# Altium schematic sheet Timebase_shcematics.SchDoc: Ultra-Precision low speed ramp generator for low current calibration
size A3; PageSetup: Record=PageOptions|CenterHorizontal=True|CenterVertical=True|PrintScale=0.52|XCorrection=1.00|YCorrection=1.00|PrintKind=0|BorderSize=5000000|LeftOffset=0|BottomOffset=0|Orientation=2|PaperLength=1000|PaperWidth=1000|Scale=100|PaperSource=7|PrintQuality=-3|MediaType=1|DitherType=10|PrintScaleMode=1|PaperKind=A4|PaperIndex=9
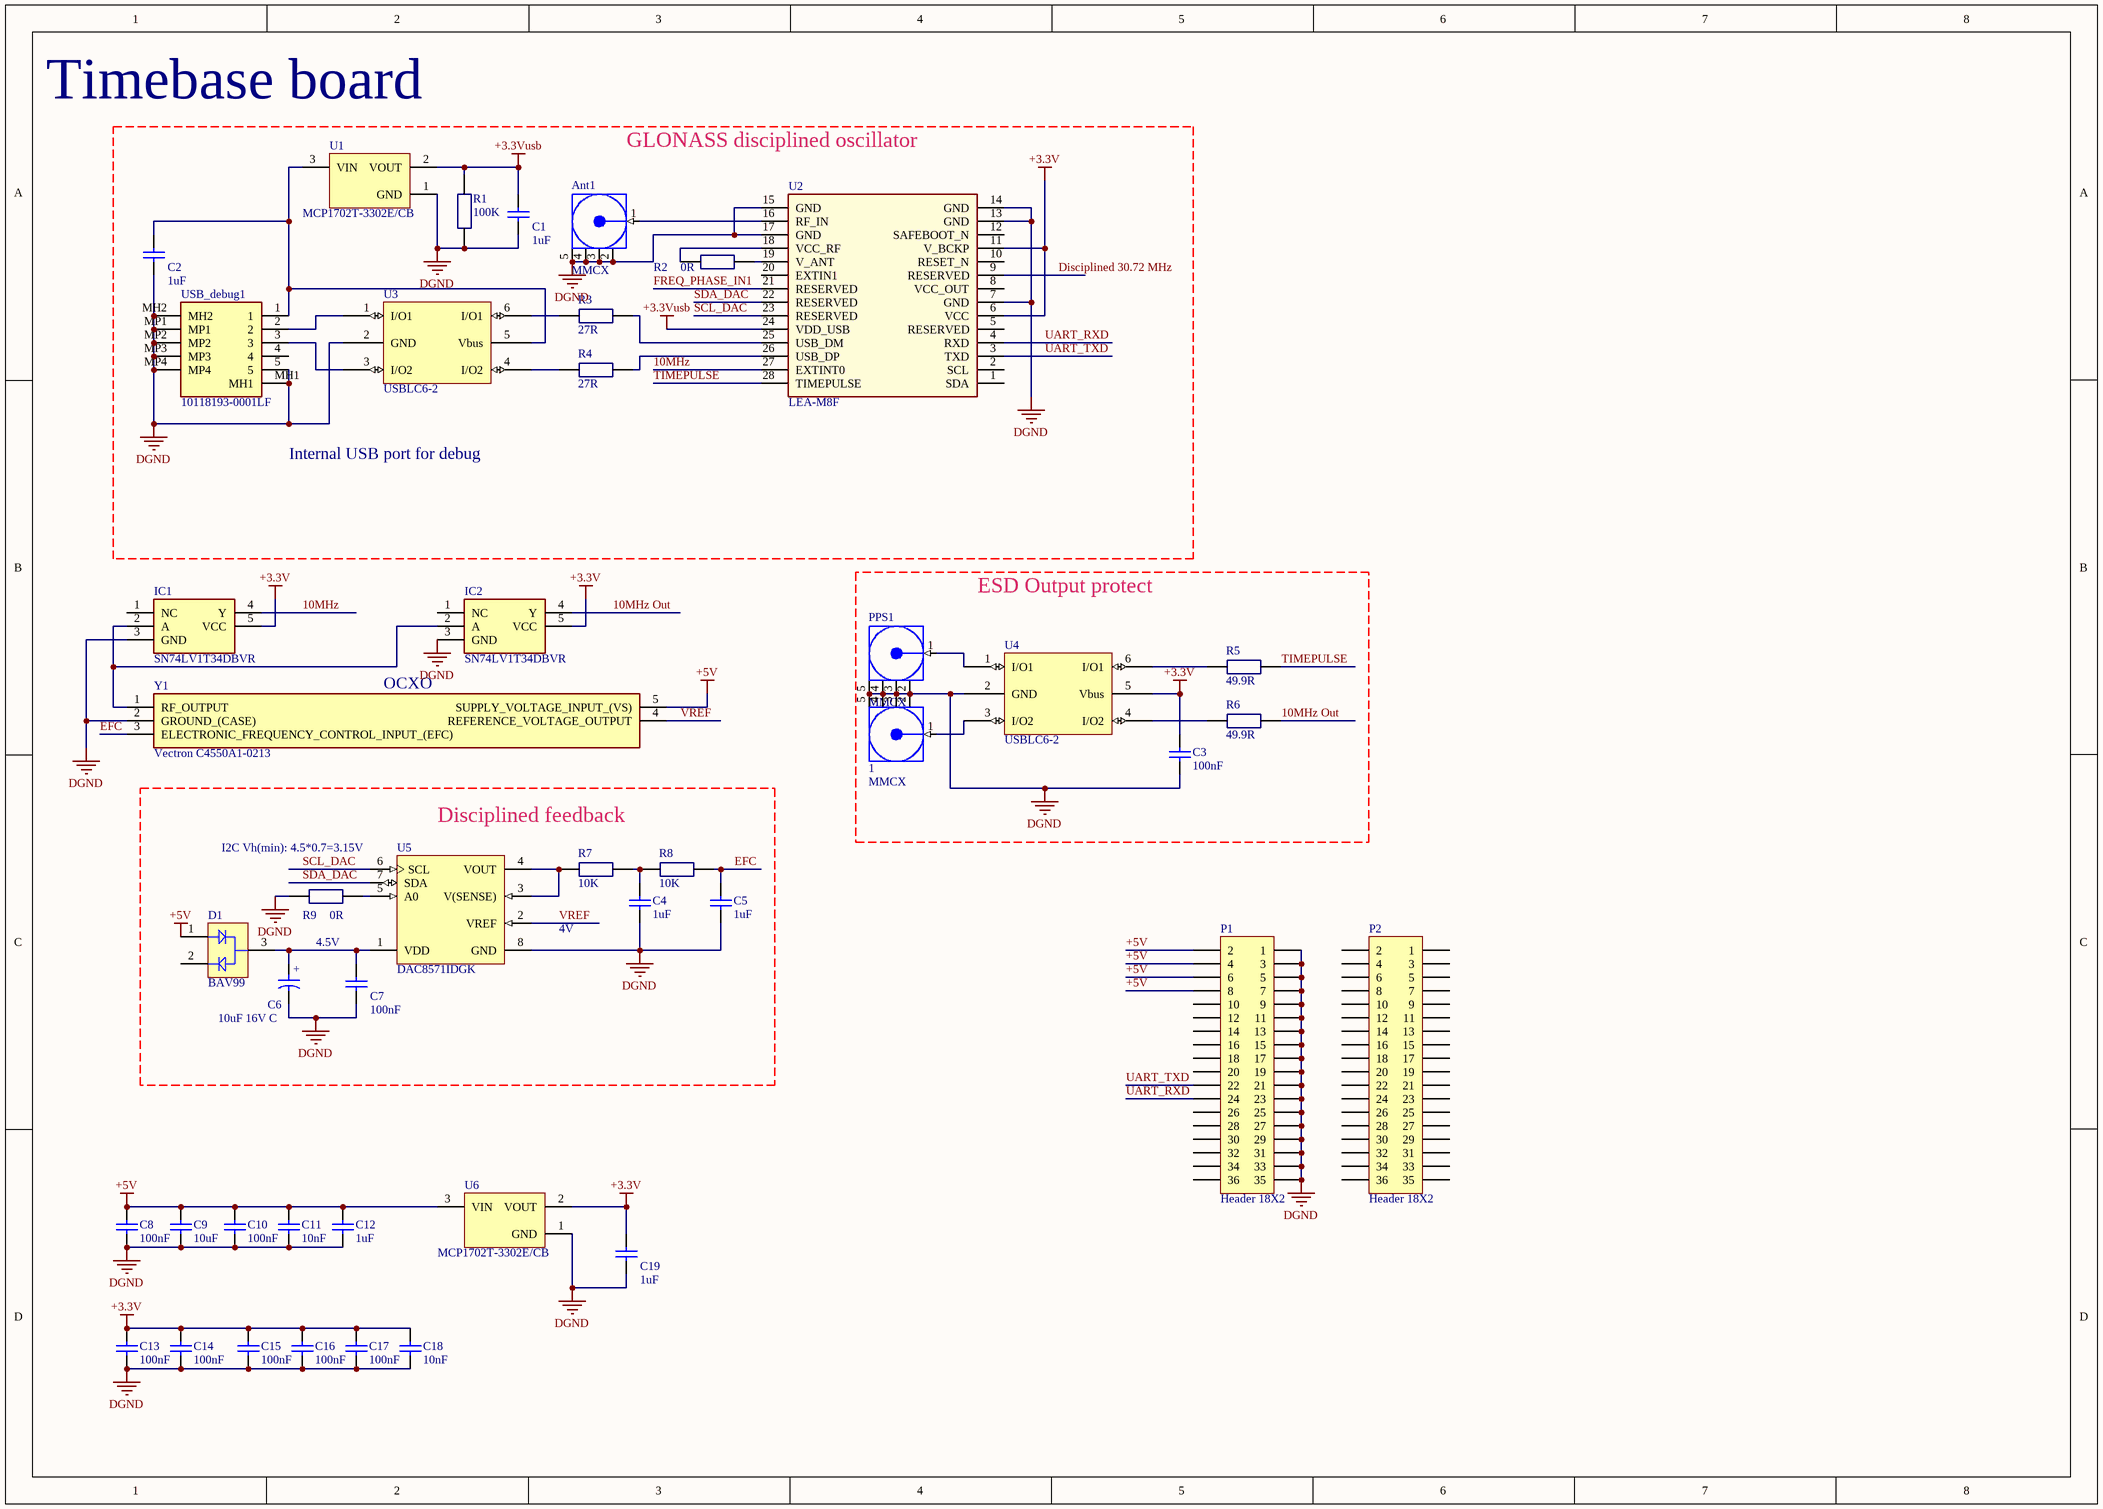
[diagram p0: Timebase_shcematics.SchDoc]

## Parts
1  MMCX  [MMCX2.54-V5]
Ant1  MMCX  [MMCX2.54-V5]
C1  1uF  [CAP 0603]
C2  1uF  [CAP 0603]
C3  100nF  [CAP 0603]
C4  1uF  [CAP 0603]
C5  1uF  [CAP 0603]
C6  10uF 16V C  [CAPMP6032X280N]
C7  100nF  [CAP 0603]
C8  100nF  [CAP 0603]
C9  10uF  [CAP 0603]
C10  100nF  [CAP 0603]
C11  10nF  [CAP 0603]
C12  1uF  [CAP 0603]
C13  100nF  [CAP 0603]
C14  100nF  [CAP 0603]
C15  100nF  [CAP 0603]
C16  100nF  [CAP 0603]
C17  100nF  [CAP 0603]
C18  10nF  [CAP 0603]
C19  1uF  [CAP 0603]
D1  BAV99  [INF-SOT23_N]
IC1  SN74LV1T34DBVR  [SOT95P280X145-5N]
IC2  SN74LV1T34DBVR  [SOT95P280X145-5N]
P1  Header 18X2  [HDR2X18]
P2  Header 18X2  [HDR2X18]
PPS1  MMCX  [MMCX2.54-V5]
R1  100K  [1608[0603]]
R2  0R  [1608[0603]]
R3  27R  [1608[0603]]
R4  27R  [1608[0603]]
R5  49.9R  [1608[0603]]
R6  49.9R  [1608[0603]]
R7  10K  [1608[0603]]
R8  10K  [1608[0603]]
R9  0R  [1608[0603]]
U1  MCP1702T-3302E/CB  [SOT-23A-CB3_N]
U2  LEA-M8F  [LEA]
U3  USBLC6-2  [SOT23-6L]
U4  USBLC6-2  [SOT23-6L]
U5  DAC8571IDGK  [TI-DGK8_N]
U6  MCP1702T-3302E/CB  [SOT-23A-CB3_N]
USB_debug1  10118193-0001LF  [101181930001LF]
Y1  Vectron C4550A1-0213  [C4550C508SV120RFSA11128MHZ]

## Blocks framed on the sheet
GLONASS disciplined oscillator: Ant1 C1 C2 R1-R4 U1-U3 USB_debug1
ESD Output protect: 1 C3 PPS1 R5 R6 U4
Disciplined feedback: C4-C7 D1 R7-R9 U5

## Nets
+3.3V: C3.2 C13.2 C14.2 C15.2 C16.2 C17.2 C18.2 C19.2 IC1.5(VCC) IC2.5(VCC) U2.6(VCC) U2.11(V_BCKP) U4.5(Vbus) U6.2(VOUT)
+3.3Vusb: C1.2 R1.1(A) U1.2(VOUT) U2.24(VDD_USB)
+5V: C8.2 C9.2 C10.2 C11.2 C12.2 D1.1(A1) P1.2 P1.4 P1.6 P1.8 U6.3(VIN) Y1.5(SUPPLY_VOLTAGE_INPUT_(VS))
DGND: 1.2(GND) 1.3(GND) 1.4(GND) 1.5(GND) Ant1.2(GND) Ant1.3(GND) Ant1.4(GND) Ant1.5(GND) C1.1 C2.1 C3.1 C4.1 C5.1 C6.2 C7.1 C8.1 C9.1 C10.1 C11.1 C12.1 C13.1 C14.1 C15.1 C16.1 C17.1 C18.1 C19.1 IC1.3(GND) IC2.3(GND) P1.1 P1.3 P1.5 P1.7 P1.9 P1.11 P1.13 P1.15 P1.17 P1.19 P1.21 P1.23 P1.25 P1.27 P1.29 P1.31 P1.33 P1.35 PPS1.2(GND) PPS1.3(GND) PPS1.4(GND) PPS1.5(GND) R1.2 R9.2 U1.1(GND) U2.7(GND) U2.13(GND) U2.14(GND) U2.15(GND) U2.17(GND) U3.2(GND) U4.2(GND) U5.8(GND) U6.1(GND) USB_debug1.5 USB_debug1.MH1 USB_debug1.MH2 USB_debug1.MP1 USB_debug1.MP2 USB_debug1.MP3 USB_debug1.MP4 Y1.2(GROUND_(CASE))
10MHz: IC1.4(Y) U2.27(EXTINT0)
10MHz Out: IC2.4(Y) R6.1(A)
Disciplined 30.72 MHz: U2.9(RESERVED)
EFC: C5.2 R8.1(A) Y1.3(ELECTRONIC_FREQUENCY_CONTROL_INPUT_(EFC))
FREQ_PHASE_IN1: U2.21(RESERVED)
SCL_DAC: U2.23(RESERVED) U5.6(SCL)
SDA_DAC: U2.22(RESERVED) U5.7(SDA)
TIMEPULSE: R5.1(A) U2.28(TIMEPULSE)
UART_RXD: P1.24 U2.4(RXD)
UART_TXD: P1.22 U2.3(TXD)
VREF: U5.2(VREF) Y1.4(REFERENCE_VOLTAGE_OUTPUT)
Net1_1: 1.1(Signal) U4.3(I/O2)
NetAnt1_1: Ant1.1(Signal) U2.16(RF_IN)
NetC2_2: C2.2 U1.3(VIN) U3.5(Vbus) USB_debug1.1
NetC4_2: C4.2 R7.1(A) R8.2
NetC6_1: C6.1 C7.2 D1.3(C) U5.1(VDD)
NetIC1_2: IC1.2(A) IC2.2(A) Y1.1(RF_OUTPUT)
NetPPS1_1: PPS1.1(Signal) U4.1(I/O1)
NetR2_1: R2.1(A) U2.19(V_ANT)
NetR2_2: R2.2 U2.18(VCC_RF)
NetR3_1: R3.1(A) U2.25(USB_DM)
NetR3_2: R3.2 U3.6(I/O1)
NetR4_1: R4.1(A) U2.26(USB_DP)
NetR4_2: R4.2 U3.4(I/O2)
NetR5_2: R5.2 U4.6(I/O1)
NetR6_2: R6.2 U4.4(I/O2)
NetR7_2: R7.2 U5.3(V(SENSE)) U5.4(VOUT)
NetR9_1: R9.1(A) U5.5(A0)
NetU3_1: U3.1(I/O1) USB_debug1.2
NetU3_3: U3.3(I/O2) USB_debug1.3

Not connected (* = marked no-connect by the designer): D1 2(K2); IC1 1(NC); IC2 1(NC); P1 10 12 14 16 18 20 26 28 30 32 34 36; P2 1 2 3 4 5 6 7 8 9 10 11 12 13 14 15 16 17 18 19 20 21 22 23 24 25 26 27 28 29 30 31 32 33 34 35 36; U2 1(SDA) 2(SCL) 5(RESERVED) 8(VCC_OUT) 10(RESET_N) 12(SAFEBOOT_N) 20(EXTIN1); USB_debug1 4

## Notes on the sheet
- Timebase board
- Internal USB port for debug
- (near Y1) OCXO
- (near U5) I2C Vh(min): 4.5*0.7=3.15V
- 4.5V
- 4V
- (in symbol CTE6032-28_10UF_25V_10%_LESR0500) +

## Library data of the parts
1 Ant1 PPS1 = COAX-M: RF Coaxial PCB Connector, MMCX; Thru-Hole, Vertical Mount Plug,  50 Ohm Impedance; PackageDocument: Rev. A, 16-Jun-1997; PCB_Layout: Complies with manufacturer's recommendation.; DrillSize: Corresponds to nominal value.; Published: 15-Jul-2004; LatestRevisionDate: 15-Jul-2004; LatestRevisionNote: Component Replaced.; DatasheetDocument: 30-May-2003; PackageReference: 908-21103; Publisher: Altium Limited; ComponentLink1Description: Manufacturer Link; ComponentLink1URL: http://www.amphenolrf.com/
C1-C5 C7-C19 = Cap Semi: Capacitor (Semiconductor SIM Model); Order: CC0603KRX7R8BB104; Published: 8-Jun-2000; LatestRevisionDate: 29-May-2009; LatestRevisionNote: IPC-7351 Footprint Added.; PackageReference: C1206; Publisher: Altium Limited; PackageDescription: Chip Capacitor
  C1 C2 C4 C5 C12 C19: Value: 1uF
  C3 C7 C8 C10 C13-C17: Value: 100nF
  C9: Value: 10uF
  C11 C18: Value: 10nF
C6 = CTE6032-28_10UF_25V_10%_LESR0500: Polarised capacitor; Part Description: Low ESR 0R5 Solid Tantalum Chip Capacitor; Manufacturer: GENERIC; Manufacturer1 Part Number: TPSC106K025R0500; Voltage: 25V; Tolerance: ±10%; Part Number: CTE6032-28_10UF_25V_10%_LESR0500; Component Kind: Standard; Component Type: Standard; Pin Count: 2; Value: 10uF 16V C; Status: Preferred; Manufacturer Part Number: CTE6032-28_10UF_25V_10%_LESR0500; Case: C; Mounted: Yes; Socket: No; SMD: Yes; Sense: No; Manufacturer1 Example: AVX; Manufacturer1 ComponentHeight: 2.8mm; HelpURL: \\cern.ch\dfs\Applications\Altium\Datasheets\CTE-LESR_AVX_TPS.pdf; Author: CERN DEM JLC; CreateDate: 05.05.2008; LatestRevisionDate: 20.01.2009
D1 = BAV99: Silicon Switching Diode, SOT23, Reel, Green; Manufacturer: Infineon; Green: TRUE; PackageVersion: Apr-08; PackageReference: SOT23; PackageDescription: 3-Pin Small Outline Transistor Package, 1.3 x 2.9 mm Body, 0.95 mm Pitch; Supplier 1: Arrow; Supplier Part Number 1: 8_hDx09NysxyY_EZJdaSbs5L1p9U5ut-2MaZMQWGOaA; Supplier 2: Farnell; Supplier Part Number 2: 1056504RL; Supplier 3: Farnell; Supplier Part Number 3: 1056504; Packing: Reel; Mounting Technology: Surface Mount; PartNumber: BAV99; ComponentLink1Description: Manufacturer URL; ComponentLink1URL: http://www.infineon.com/; ComponentLink2Description: Datasheet; ComponentLink2URL: http://www.infineon.com/dgdl/bav99series.pdf?folderId=db3a30431400ef6801141b5844e103ea&fileId=db3a30431400ef6801141c1b237d042f; ComponentLink3Description: Package Specification; ComponentLink3URL: http://www.infineon.com/dgdl/smbta14_mmbta14.pdf?folderId=db3a30431441fb5d011445c30f210183&fileId=db3a30431441fb5d011445ef0201018c
IC1 IC2 = SN74LV1T34DBVR: Integrated Circuit; Manufacturer_Name: Texas Instruments; Datasheet Link: http://www.ti.com/lit/gpn/sn74lv1t34; Height: 1.45mm; Manufacturer_Part_Number: SN74LV1T34DBVR; Mouser Part Number: 595-SN74LV1T34DBVR; Mouser Price/Stock: https://www.mouser.co.uk/ProductDetail/Texas-Instruments/SN74LV1T34DBVR?qs=8sOby8ZxZLE4ekkxA3S6Wg%3D%3D; Arrow Part Number: SN74LV1T34DBVR; Arrow Price/Stock: https://www.arrow.com/en/products/sn74lv1t34dbvr/texas-instruments?region=nac
P1 P2 = Header 18X2: Header, 18-Pin, Dual row; System: Connector; LatestRevisionDate: 17-Jul-2002; LatestRevisionNote: Re-released for DXP Platform.; Publisher: Altium Limited
R1-R9 = Resistor 0805: Order: CR0603-JW-220GLF; Avail: 20
  R1: Value: 100K
  R2 R9: Value: 0R
  R3 R4: Value: 27R
  R5 R6: Value: 49.9R
  R7 R8: Value: 10K
U1 U6 = MCP1702T-3302E/CB: 250 mA Low Quiescent Current LDO Regulator, 3-Pin SOT-23A, Extended Temperature, Tape and Reel; Published: 29-Jan-2009; LatestRevisionDate: 02-Dec-2009; LatestRevisionNote: Updated to datasheet revision D, Jun-2009; DatasheetVersion: revD, Jun-2009; PackageVersion: revBB, Aug-2009; PackageReference: SOT-23A-CB3; Publisher: Altium Limited; PackageDescription: 3-Lead Plastic Small Outline Transistor (CB) [SOT-23A]; Supplier 1: Digi-Key; Supplier Part Number 1: MCP1702T-3302E/CBTR-ND; Supplier 2: Digi-Key; Supplier Part Number 2: MCP1702T-3302E/CBCT-ND; Supplier 3: Digi-Key; Supplier Part Number 3: MCP1702T-3302E/CBDKR-ND; Supplier 4: Farnell; Supplier Part Number 4: 1331490; ComponentLink1Description: Datasheet; ComponentLink1URL: http://ww1.microchip.com/downloads/en/DeviceDoc/22008d.pdf; ComponentLink2Description: Packaging Specification; ComponentLink2URL: http://www.microchip.com/stellent/groups/techpub_sg/documents/packagingspec/en012702.pdf; ComponentLink3Description: Microchip.com Home; ComponentLink3URL: http://www.microchip.com/
U2 = LEA: u-blox LEA GNSS module; Part Description: u-blox LEA-M8 GNSS module; Manufacturer: u-blox; Value: LEA-M8F
U3 U4 = USBLC6-2: Avail: 1; Order: USBLC6-2
U5 = DAC8571IDGK: Low-Power Rail-to-Rail Output 16-Bit I2C Input DAC, -40 to 105 degC, 8-pin SOP (DGK8), Green (RoHS & no Sb/Br); Manufacturer: Texas Instruments; DAC Channels: 1; INL(Max)(+/-LSB): 65; Interface: Serial I2C; Power Consumption(Typ)(mW): 0.42; Resolution(Bits): 16; Settling Time(us): 8; SubFamily: Precision DAC (=<10MSPS); DatasheetVersion: SLAS373A; PackageVersion: 4073329/E, 05/2006; PackageReference: DGK8; PackageDescription: 8-Pin Thin Small Outline, Body 3 x 3 mm, Pitch 0.65 mm; Supplier 1: Digi-Key; Supplier Part Number 1: 296-26051-5-ND; Supplier 2: Newark; Supplier Part Number 2: 20H5068; Supplier 3: Mouser; Supplier Part Number 3: 595-DAC8571IDGK; DNL(Max)(+/-LSB): 1; Eco-Plan: Green (RoHS & no Sb/Br); Mounting Technology: Surface Mount; Code_JEDEC: MO-187; PartNumber: DAC8571IDGK; ComponentLink1Description: Manufacturer URL; ComponentLink1URL: http://www.ti.com/; ComponentLink2Description: Datasheet; ComponentLink2URL: http://www.ti.com/general/docs/lit/getliterature.tsp?genericPartNumber=DAC8571&fileType=pdf; ComponentLink3Description: Package Specification; ComponentLink3URL: http://www.ti.com/litv/pdf/mpds028d
USB_debug1 = 10118193-0001LF: Connector; Manufacturer_Name: Amphenol; Datasheet Link: https://datasheet.datasheetarchive.com/originals/distributors/Datasheets_SAMA/035be5b62fc6b7a9cadde58b72893b5e.pdf; Height: 3.1mm; Manufacturer_Part_Number: 10118193-0001LF; Mouser Part Number: 649-10118193-0001LF; Mouser Price/Stock: https://www.mouser.co.uk/ProductDetail/Amphenol-FCI/10118193-0001LF?qs=Ywefl8B65e63Nsqd%252B8HZaQ%3D%3D; Arrow Part Number: 10118193-0001LF; Arrow Price/Stock: https://www.arrow.com/en/products/10118193-0001lf/amphenol-fci?region=nac
Y1 = C4550C508SV120RFSA1112.8MHZ: Crystal or Oscillator; Height: 11.25mm; Manufacturer_Name: Vectron; Manufacturer_Part_Number: Vectron C4550A1-0213